# EAGLE design 918B (EAGLE 9.5.2)
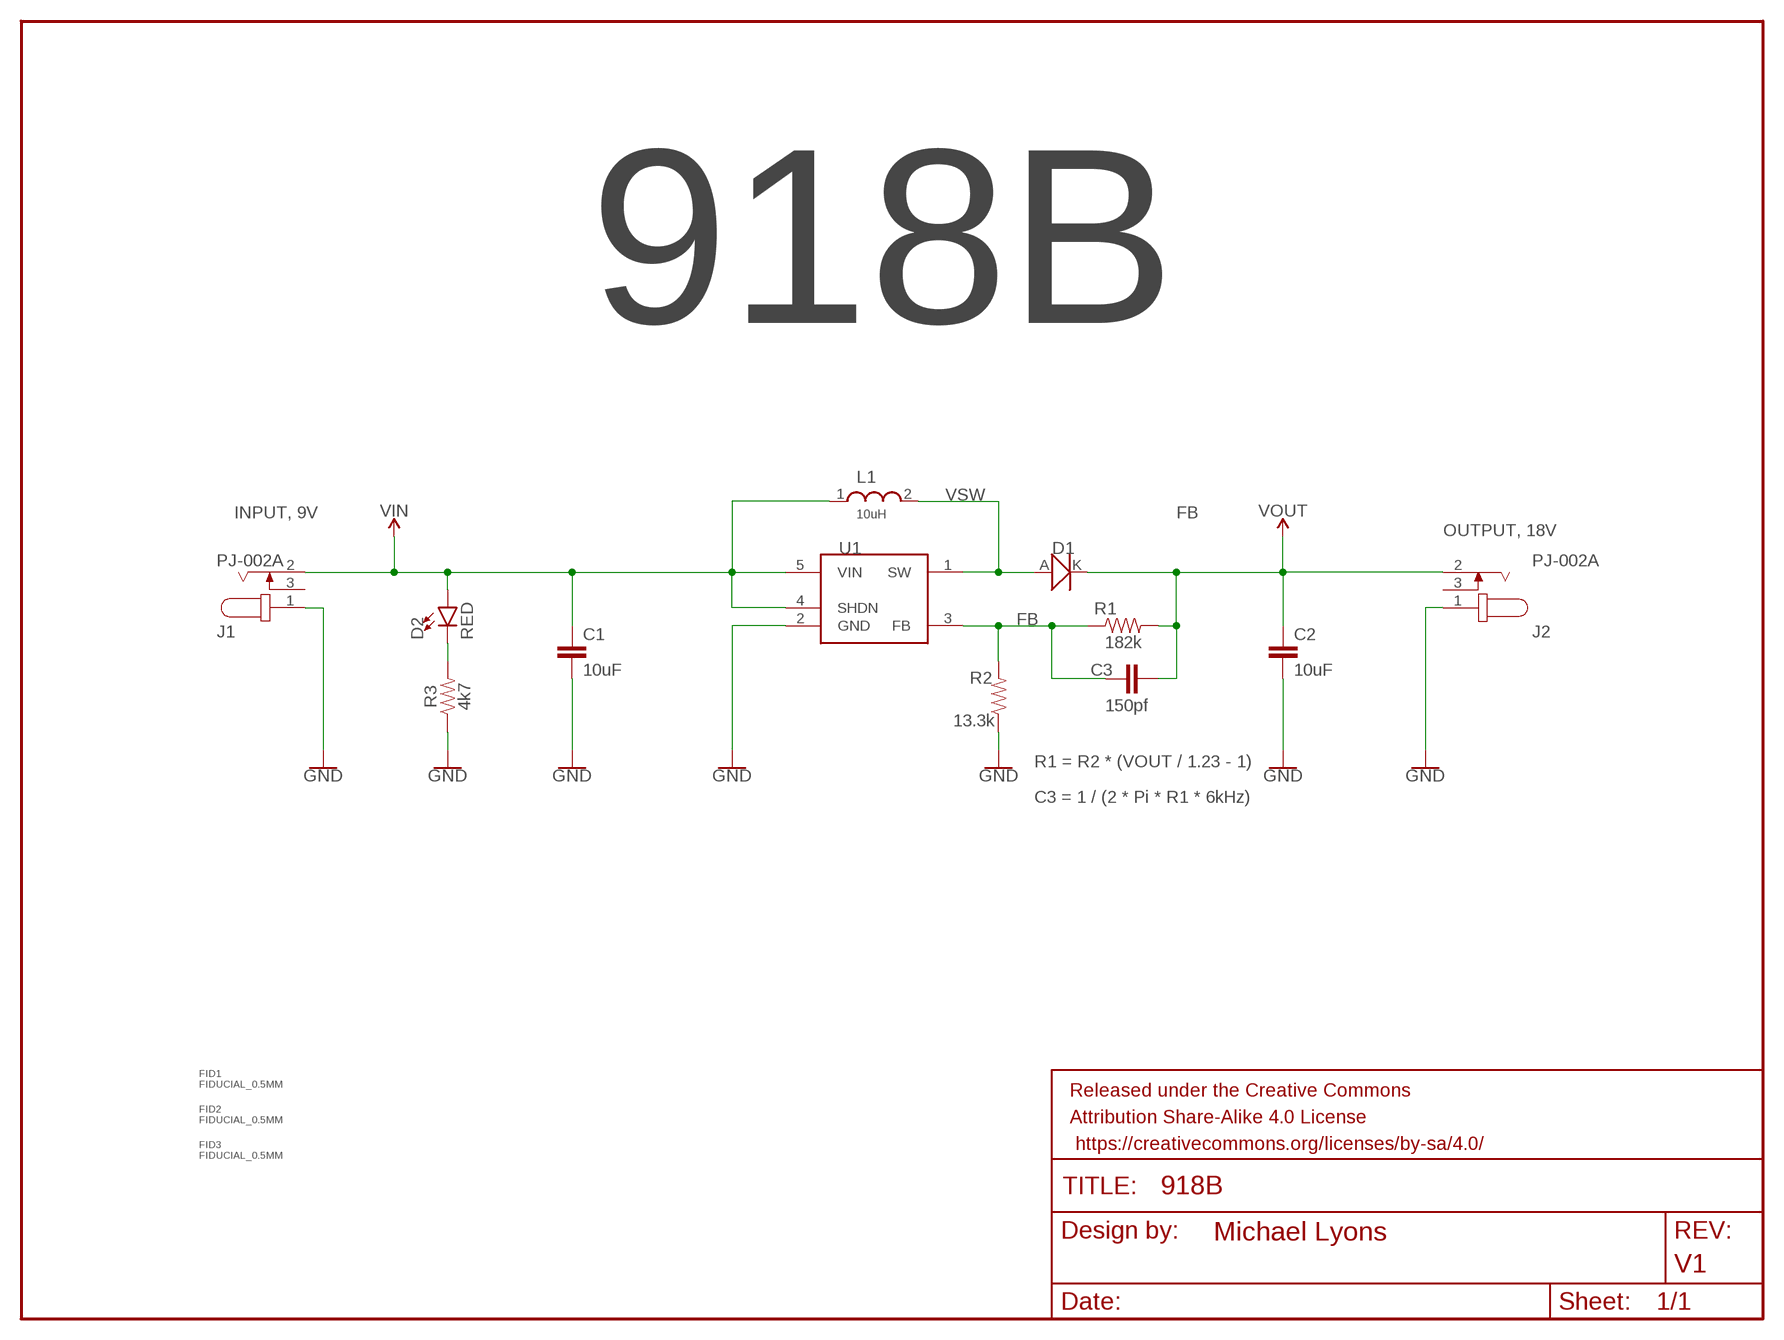
[diagram p0: schematic, sheet 1]

## Parts
C1  10uF  10UF-0805-25V-10%  [0805]
C2  10uF  10UF-0805-25V-10%  [0805]
C3  150pf  CAP-0402  [0402]
D1  PMEG4030EP,115  [PMEG4030EP,115]
D2  RED  LED-RED0603  [LED-0603]
FID1  FIDUCIAL_0.5MM  [FIDUCIAL_0.5MM]
FID2  FIDUCIAL_0.5MM  [FIDUCIAL_0.5MM]
FID3  FIDUCIAL_0.5MM  [FIDUCIAL_0.5MM]
FRAME1  FRAME-LETTER  [CREATIVE_COMMONS]
J1  PJ-002A  [CUI_PJ-002A]
J2  PJ-002A  [CUI_PJ-002A]
L1  10uH  NR10050T100M  [NR10050T100M]
R1  182k  RESISTOR0402  [0402]
R2  13.3k  RESISTOR0402  [0402]
R3  4k7  RESISTOR0402  [0402]
U1  LMR62014XM  [SOT-23-5]

## Nets
FB: C3.1 R1.1 R2.2 U1.3(FB)
GND: C1.2 C2.2 J1.1 J2.1 R2.1 R3.1 U1.2(GND)
NR3: D2.C R3.2
VIN: C1.1 D2.A J1.2 L1.1 U1.4(SHDN) U1.5(VIN)
VOUT: C2.1 C3.2 D1.K J2.2 R1.2
VSW: D1.A L1.2 U1.1(SW)
Unconnected: J1.3 J2.3

## Notes on the sheet
- 918B
- INPUT, 9V
- OUTPUT, 18V
- R1 = R2 * (VOUT / 1.23 - 1)
- C3 = 1 / (2 * Pi * R1 * 6kHz)

## Library data of the parts
C1 C2 = SparkFun-Capacitors:10UF: 10.0µF ceramic capacitors A capacitor is a passive two-terminal electrical component used to store electrical energy temporarily in an electric field.; MPN: GRM21BR61E106KA73L; PROD_ID: CAP-14259
C3 = SparkFun-Capacitors:CAP; MPN: C0402C151J5GACTU
D1 = michael:PMEG4030EP,115; MPN: PMEG4030EP,115
D2 = SparkFun-LED:LED-RED: Red SMD LED Used in manufacturing of most products at SparkFun Packages: 0603 - SMD 0603 package [Product Link] <http://docs.avagotech.com/docs/AV02-0551EN> 0603 SMART - SMD 0603 SMART package ( more efficient and expensive)[Product Link] <http://www.osram-os.com/Graphics/XPic2/00077099_0.pdf> 1206 - SMD1206 package [Product Link] <https://www.sparkfun.com/datasheets/DevTools/LilyPad/Q150OVS4.pdff> SparkFun Products: Pro Mini 328 -5V <https://www.sparkfun.com/products/821> RedBoard <https://www.sparkfun.com/products/12757> IOIO-OTG <https://www.sparkfun.com/products/13613>; MPN: HSMC-C190; PROD_ID: DIO-00819
FID1-FID3 = MF_Aesthetics:FIDUCIAL: Library: MF_Aesthetics Description: Fiducial marking for PCB alignment inside PNP and other machines.; HOUSEPART: NO; POPULATE: 0
FRAME1 = SparkFun-Aesthetics:FRAME-LETTER: Schematic Frame - Letter Standard 8.5x11 US Letter frame; DESIGNER: Michael Lyons; REV: V1
J1 J2 = PJ-002A:PJ-002A: 2.0 mm Center Pin, 2.5 A, Right Angle, Through Hole, Dc Power Jack Connector; AVAILABILITY: Unavailable; CUI_PURCHASE_URL: https://www.cuidevices.com/product/interconnect/connectors/dc-power-connectors/jacks/pj-002a?utm_source=snapeda.com&utm_medium=referral&utm_campaign=snapedaBOM; DESCRIPTION: 2.0 x 6.5 mm, 2.5 A, Horizontal, Through Hole, Dc Power Jack Connector; MF: CUI Devices; MP: PJ-002A; MPN: PJ-002A; PACKAGE: None; PRICE: None
L1 = michael:NR10050T100M; MPN: NR10050T100M
R1 = SparkFun-Resistors:RESISTOR: Generic Resistor Package; MPN: RC0402FR-07182KL
R2 = SparkFun-Resistors:RESISTOR: Generic Resistor Package; MPN: RC0402FR-0713K3L
R3 = SparkFun-Resistors:RESISTOR: Generic Resistor Package; MPN: RC0402JR-074K7L
U1 = michael:LMR62014XM; MPN: LMR62014XMFX/NOPB

## Board
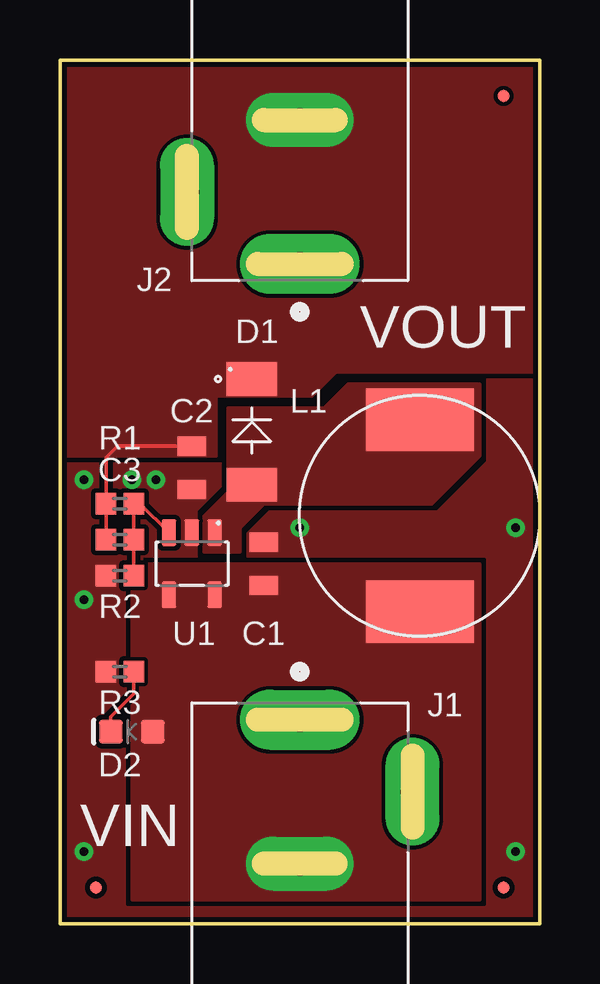
[diagram p1: board, top side]
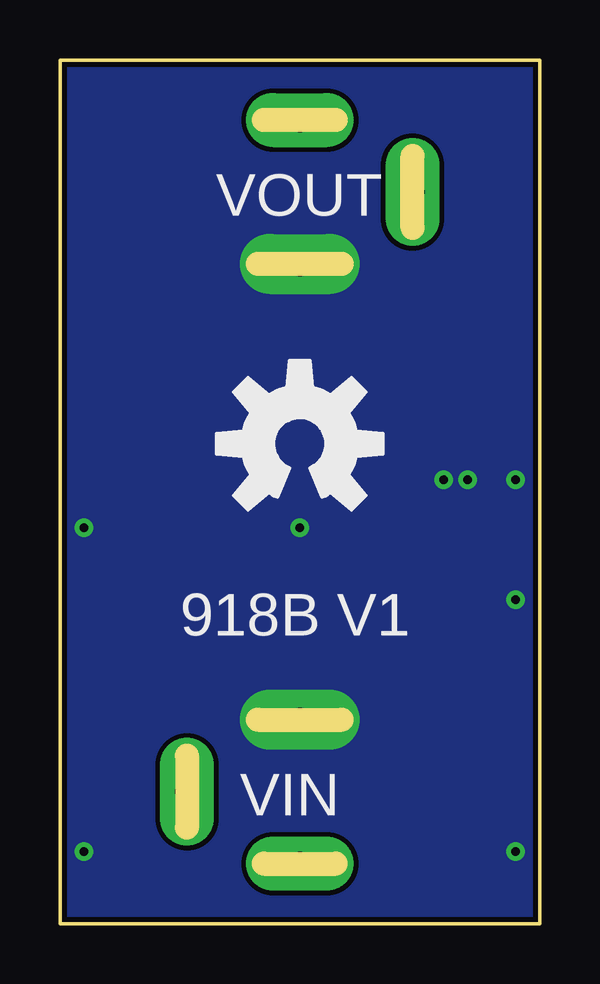
[diagram p2: board, bottom side, seen from below]

Size 20 x 36 mm. Coordinates in mm from the lower left corner, seen from the top.
Outline: 0,36 0,0 20,0 20,36 0,36
Copper layers (1*16): Top 0.035mm / dielectric 1.5mm / Bottom 0.035mm
Design rules "default *": minimum track width 6mil, minimum drill 0.35mm, track to track 6mil, track to pad 6mil, pad to pad 6mil, via to via 6mil, smd to smd 6mil, copper to edge 8mil, drill to drill 6mil, minimum pad ring 10mil, minimum via ring 8mil, stop-mask expansion 4mil, vias tented up to drill 20mil, thermal gap 10mil

### Footprints (pad centres in the part's own frame; a part is rotated, then mirrored left to right if it is on the bottom)
0805 = smd 0.8 x 1.2: 1 -0.9,0; 2 0.9,0
0402 = smd 0.85 x 0.9: 1 -0.58,0; 2 0.58,0
PMEG4030EP,115 = smd 1.4 x 2.1: A -2.2,0; K 2.2,0
LED-0603 = smd 1 x 1: A -0.877,0; C 0.877,0
FIDUCIAL_0.5MM = smd 0.5 x 0.5: FID 0,0
CUI_PJ-002A = drill 1 pad 2.5 long: 1 0,0 | drill 1 pad 2.25 long: 2 6,0; 3 3,4.7
NR10050T100M = smd 2.6 x 4.5: 1 -4,0; 2 4,0
SOT-23-5 = smd 1.1 x 0.6: 1 -1.3,0.95; 2 -1.3,0; 3 -1.3,-0.95; 4 1.3,-0.95; 5 1.3,0.95

### Placement (x,y rotation side)
C1  8.5,15 90 top
C2  5.5,19 270 top
C3  2.5,16 180 top
D1  8,20.5 90 top
D2  3,8 180 top
FID1  1.5,1.5 0 top
FID2  18.5,1.5 0 top
FID3  18.5,34.5 0 top
FRAME1  -10.51,-16.25 0 top  (outside the outline)
J1  10,8.5 270 top
J2  10,27.5 90 top
L1  15,17 90 top
R1  2.5,17.5 180 top
R2  2.5,14.5 0 top
R3  2.5,10.5 0 top
U1  5.5,15 270 top
U$1  [OSHW-LOGO-L]  10,20 0 bottom

### Tracks (layer width: path | path; a pad name or v marks a point on that pad's centre or on a via)
FB
  Top 0.152: U1.3 3.35,17.5 R1.1 C3.1 R2.2
GND  (via drill 0.35)
  other vias: 1,18.5 3,18.5 4,18.5 10,16.5 19,16.5 19,3 1,3 1,13.5
  pour Bottom (isolate 0.2, no thermals): 0,0 0,36 20,36 20,0
  pour Top (isolate 0.2, rank 4, no thermals): 0,0 0,36 20,36 20,0
NR3
  Top 0.152: D2.C 2.12,8.62 3.08,9.58 R3.2
VIN
  pour Top (no thermals): 17.5,1 3,1 3,15 17.5,15
VOUT
  Top 0.152: C3.2 1.92,16.08 R1.2 1.92,19.42 2.4,19.9 C2.1
  pour Top (no thermals): 6.5,19.5 0,19.5 0,36 20,36 20,23 11.5,23 10.5,22 6.5,22
VSW
  pour Top (no thermals): 6,15.5 6,17 7,18 7,21.5 11,21.5 12,22.5 17.5,22.5 17.5,19.5 15.5,17.5 8.5,17.5 7.5,16.5 7.5,15.5

### Text on the board
tPlace: VOUT | VIN
bPlace: VOUT | 918B V1 | VIN